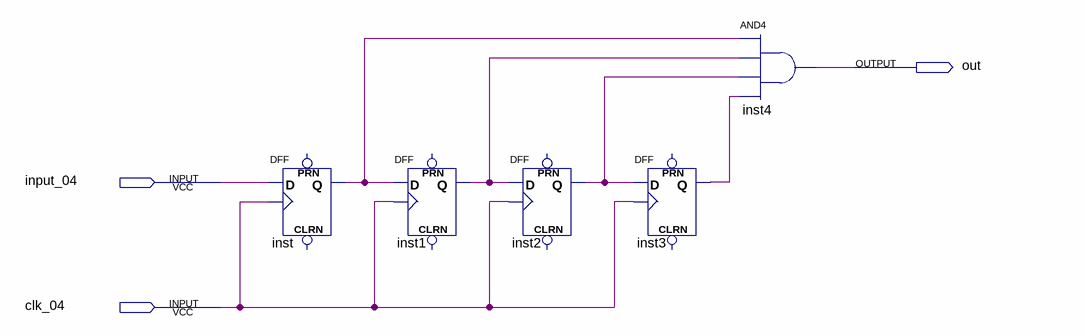
[diagram p0: schematic sheet]
// Quartus schematic anti_vib_04.bdf as structural Verilog: 5 symbols, 3 pins
module anti_vib_04 (
  input  input_04,
  input  clk_04,
  output out
);

  wire inst1_q, inst2_q, inst3_q, inst_q;

  DFF inst (.CLK(clk_04), .D(input_04), .Q(inst_q));  // open: CLRN, PRN
  DFF inst1 (.CLK(clk_04), .D(inst_q), .Q(inst1_q));  // open: CLRN, PRN
  DFF inst2 (.CLK(clk_04), .D(inst1_q), .Q(inst2_q));  // open: CLRN, PRN
  DFF inst3 (.CLK(clk_04), .D(inst2_q), .Q(inst3_q));  // open: CLRN, PRN
  and inst4 (out, inst_q, inst1_q, inst2_q, inst3_q);
endmodule
